# EAGLE design C64_Combi_PSU (EAGLE 9.2.2)
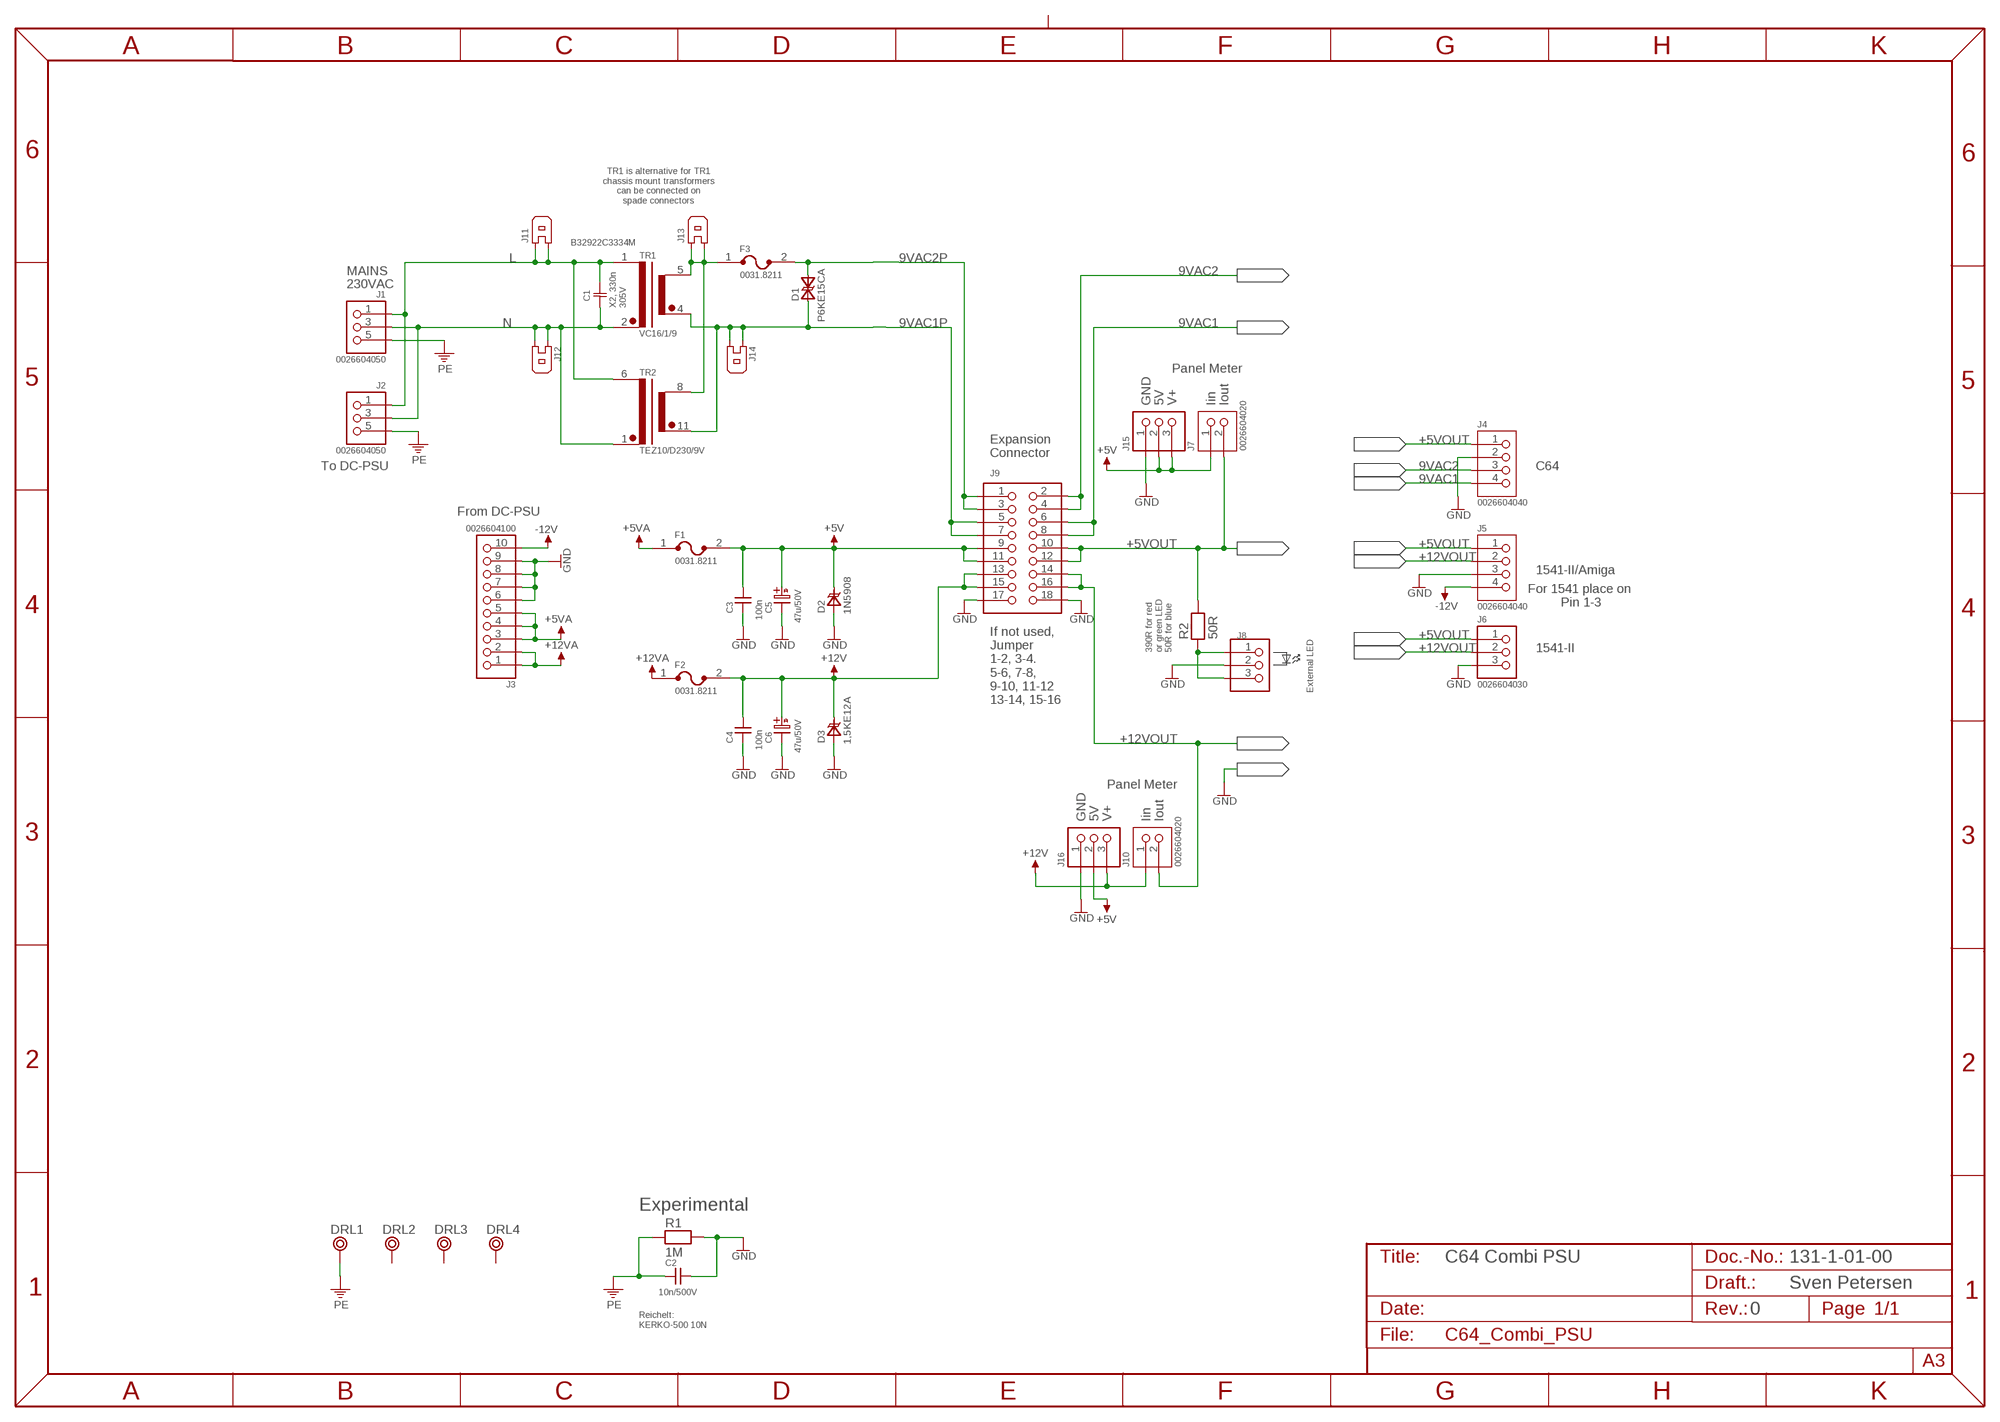
[diagram p0: schematic, sheet 1]

## Parts
C1  B32922C3334M  X2--RM15-18X8  [C-18X8-RM15]
C2  10n/500V  CAP02  [C-5]
C3  100n  CAP01  [C-2,5]
C4  100n  CAP01  [C-2,5]
C5  47u/50V  C07/2,5  [C07/2,5]
C6  47u/50V  C07/2,5  [C07/2,5]
D1  P6KE15CA  [CB417NP]
D2  1N5908  [CB429]
D3  1,5KE12A  [DO-201]
DRL1  BOHR3,5  [BOHR3,5]
DRL2  BOHR3,5  [BOHR3,5]
DRL3  BOHR3,5  [BOHR3,5]
DRL4  BOHR3,5  [BOHR3,5]
F1  0031.8211  [0031.8211]
F2  0031.8211  [0031.8211]
F3  0031.8211  [0031.8211]
J1  0026604050  0026604050MOD  [SPOX_3.96_5P3]
J2  0026604050  0026604050MOD  [SPOX_3.96_5P3]
J3  0026604100  [SPOX_3.96_10P]
J4  0026604040  [SPOX_3.96_4P]
J5  0026604040  [SPOX_3.96_4P]
J6  0026604030  [SPOX_3.96_3P]
J7  0026604020  [SPOX_3.96_2P]
J8  PINHD-1X3  [1X03]
J9  PINHD-2X9  [2X09]
J10  0026604020  [SPOX_3.96_2P]
J11  FLA6,3  [FLA6,3]
J12  FLA6,3  [FLA6,3]
J13  FLA6,3  [FLA6,3]
J14  FLA6,3  [FLA6,3]
J15  6410-3P  [6410-3P]
J16  6410-3P  [6410-3P]
R1  1M  RES04  [R-10]
R2  50R  RES04  [R-10]
TR1  VC16/1/9  [VC16/1/9]
TR2  TEZ10/D230/9V  [TEZ10]

## Nets
9VAC1: J4.4 J9.6 J9.8
9VAC1P: D1.A(A1) J9.5 J9.7 J14.1 J14.2 TR1.4(SEC12) TR2.11(SEC12)
9VAC2: J4.3 J9.2 J9.4
9VAC2P: D1.K(A2) F3.2 J9.1 J9.3
+5V: C3.2 C5.A(+) D2.K F1.2 J7.1 J9.9 J9.11 J15.2 J15.3 J16.2
+5VA: F1.1 J3.3 J3.4 J3.5
+5VOUT: J4.1 J5.1 J6.1 J7.2 J9.10 J9.12 R2.2
+12V: C4.2 C6.A(+) D3.K F2.2 J9.13 J9.15 J10.1 J16.3
+12VA: F2.1 J3.1 J3.2
+12VOUT: J5.2 J6.2 J9.14 J9.16 J10.2
-12V: J3.10 J5.4
GND: C2.2 C3.1 C4.1 C5.K(-) C6.K(-) D2.A D3.A J3.6 J3.7 J3.8 J3.9 J4.2 J5.3 J6.3 J8.2 J9.17 J9.18 J15.1 J16.1 R1.2
L [mains]: C1.2 J1.1 J2.1 J11.1 J11.2 TR1.1(PRI1) TR2.6(PRI1)
N [mains]: C1.1 J1.3 J2.3 J12.1 J12.2 TR1.2(PRI2) TR2.1(PRI2)
N$1: F3.1 J13.1 J13.2 TR1.5(SEC11) TR2.8(SEC11)
N$2: J8.1 J8.3 R2.1
PE [PE]: C2.1 DRL1.P$1 J1.5 J2.5 R1.1
Unconnected: DRL2.P$1 DRL3.P$1 DRL4.P$1

## Notes on the sheet
- TR1 is alternative for TR1
  chassis mount transformers
  can be connected on
  spade connectors
- MAINS
- 230VAC
- X2, 330n
  305V
- Panel Meter
- GND | 5V | V+ | Iin | Iout
- Expansion
  Connector
- To DC-PSU | C64
- From DC-PSU
- 1541-II/Amiga
- For 1541 place on 
  Pin 1-3
- 390R for red
  or green LED
  50R for blue
- 1541-II
- External LED
- If not used,
  Jumper
  1-2, 3-4.
  5-6, 7-8,
  9-10, 11-12
  13-14, 15-16
- Panel Meter
- GND | 5V | V+ | Iin | Iout
- Experimental
- C64 Combi PSU | 131-1-01-00
- Sven Petersen
- 0
- Reichelt:
  KERKO-500 10N

## Library data of the parts
C1 = Epcos_EMV:X2-*: X2-Kondensatoren
C2 = DISCRETE:CAP02
C3 C4 = DISCRETE:CAP01
C5 C6 = ELCO:C07/2,5
D1 = ST:P6KE15CA
D2 = ST:1N5908
D3 = ST:1,5KE12A
DRL1-DRL4 = Mech_Bohr:BOHR3,5
F1-F3 = Schurter:0031.8211
J1 J2 = MOLEX:0026604050MOD
J3 = MOLEX:0026604100
J4 J5 = MOLEX:0026604040
J6 = MOLEX:0026604030
J7 J10 = MOLEX:0026604020
J8 = PINHEAD:PINHD-1X3
J9 = PINHEAD:PINHD-2X9
J11-J14 = Connect:FLA6,3
J15 J16 = MOLEX:6410-3P: 6410/22-27-2031
R1 R2 = DISCRETE:RES04
TR1 = Block:VC16/1/9
TR2 = Breve Tufvassons:TEZ10/D230/9V: tme.eu: TEZ10/D/9V

## Net classes
1 mains: width 1.016 mm, drill 0.6 mm, clearance 5 mm to class 0, clearance 5 mm
2 PE: width 1.016 mm, drill 0.6 mm, clearance 1.5 mm to class 0, clearance 5 mm to class 1

## Board
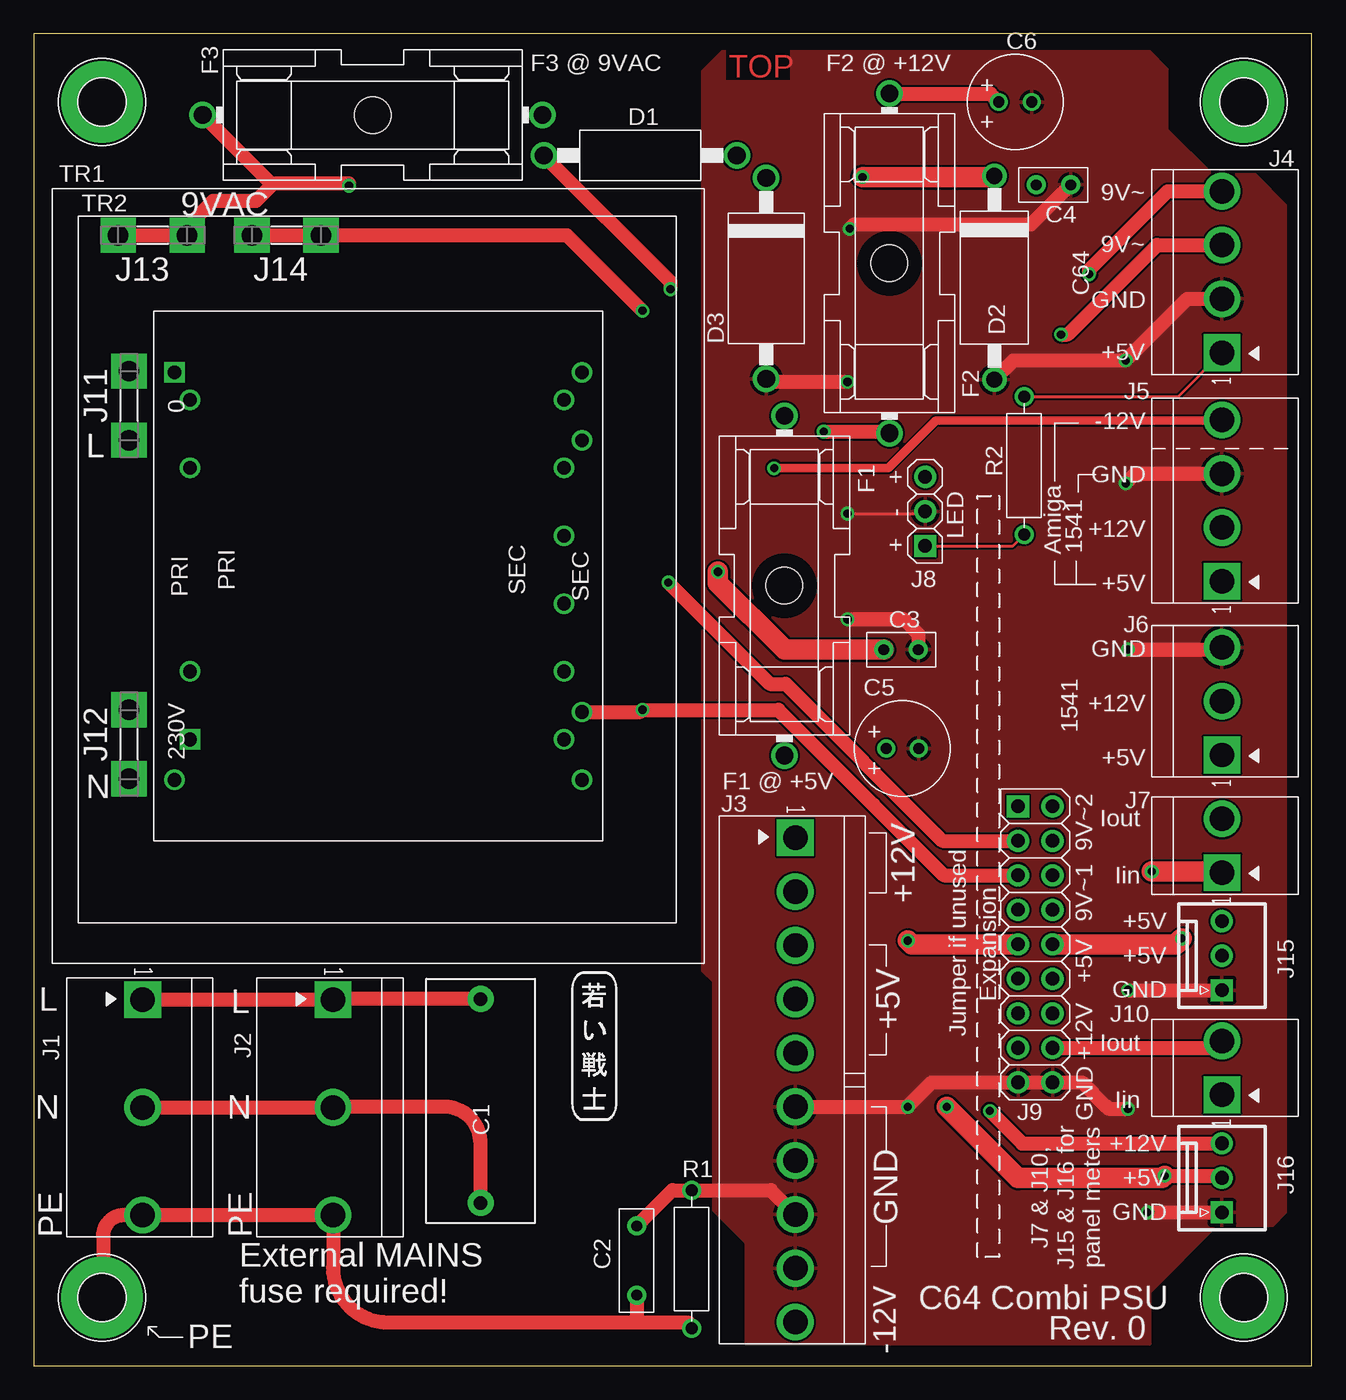
[diagram p1: board, top side]
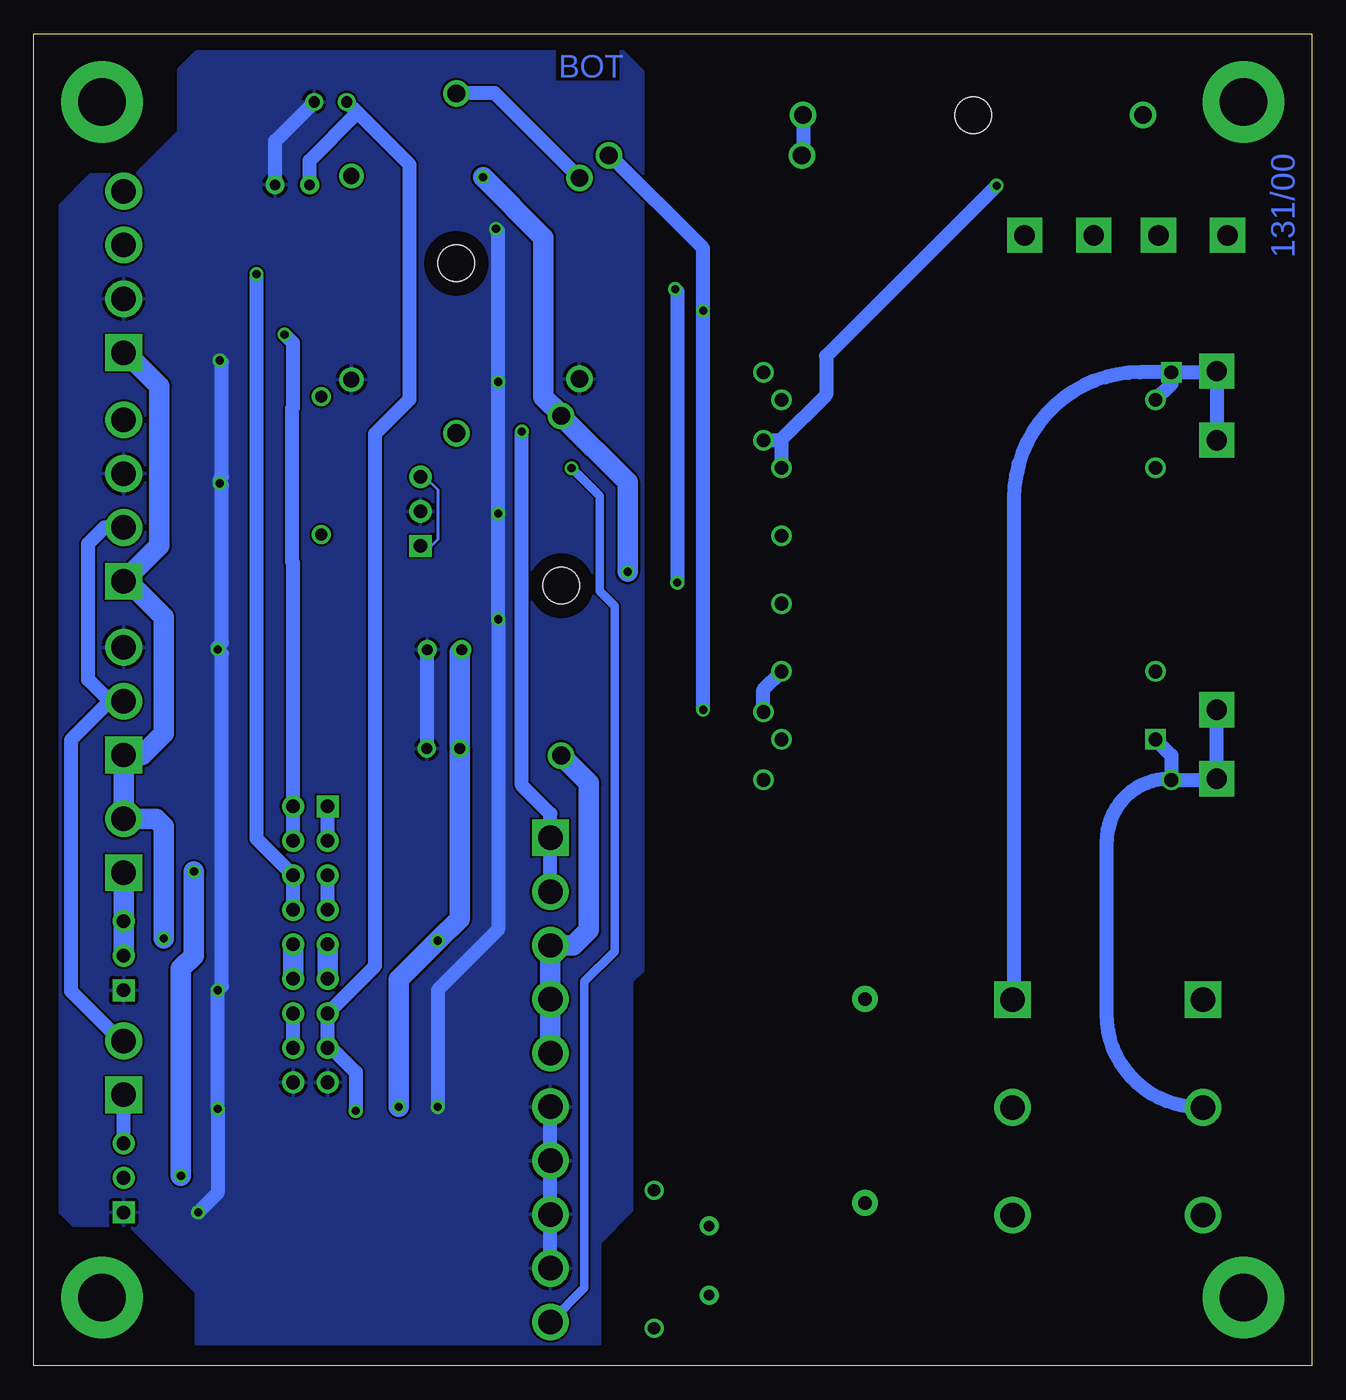
[diagram p2: board, bottom side, seen from below]

Size 94 x 98 mm. Coordinates in mm from the lower left corner, seen from the top.
Outline: 0,0 94,0 94,98 0,98 0,0
Copper layers (1*16): Top 0.035mm / dielectric 1.5mm / Bottom 0.035mm
Design rules "default *": minimum track width 6mil, minimum drill 0.35mm, track to track 6mil, track to pad 6mil, pad to pad 6mil, via to via 6mil, smd to smd 6mil, copper to edge 40mil, drill to drill 6mil, minimum pad ring 10mil, minimum via ring 8mil, stop-mask expansion 4mil, vias tented up to drill 25mil, thermal gap 10mil

### Footprints (pad centres in the part's own frame; a part is rotated, then mirrored left to right if it is on the bottom)
C-18X8-RM15 = drill 1 pad 1.905: 1 -7.5,0; 2 7.5,0
C-5 = drill 0.8 pad 1.397: 1 -2.54,0; 2 2.54,0
C-2,5 = drill 0.8 pad 1.397: 1 -1.27,0; 2 1.27,0
C07/2,5 = drill 0.813 pad 1.27: A -1.202,0; K 1.202,0
CB417NP = drill 1.3: A -7.1,0; K 7.1,0
CB429 = drill 1.2: A -7.5,0; K 7.5,0
DO-201 = drill 1.3: A -7.4,0; K 7.4,0
BOHR3,5 = drill 3.5 pad 6: P$1 0,0
0031.8211 = drill 1.3: 1 -12.5,0; 2 12.5,0 | hole 2.7: 0,0
SPOX_3.96_5P3 = drill 1.8 square: 1 -7.92,0 | drill 1.8: 3 0,0; 5 7.92,0
SPOX_3.96_10P = drill 1.8 square: 1 -17.82,0 | drill 1.8: 2 -13.86,0; 3 -9.9,0; 4 -5.94,0; 5 -1.98,0; 6 1.98,0; 7 5.94,0; 8 9.9,0; 9 13.86,0; 10 17.82,0
SPOX_3.96_4P = drill 1.8 square: 1 -5.94,0 | drill 1.8: 2 -1.98,0; 3 1.98,0; 4 5.94,0
SPOX_3.96_3P = drill 1.8 square: 1 -3.96,0 | drill 1.8: 2 0,0; 3 3.96,0
SPOX_3.96_2P = drill 1.8 square: 1 -1.98,0 | drill 1.8: 2 1.98,0
1X03 = drill 1 pad 1.626 square: 1 -2.54,0 | drill 1 pad 1.626: 2 0,0; 3 2.54,0
2X09 = drill 1 pad 1.626 square: 1 -10.16,-1.27 | drill 1 pad 1.626: 2 -10.16,1.27; 3 -7.62,-1.27; 4 -7.62,1.27; 5 -5.08,-1.27; 6 -5.08,1.27; 7 -2.54,-1.27; 8 -2.54,1.27; 9 0,-1.27; 10 0,1.27; 11 2.54,-1.27; 12 2.54,1.27; 13 5.08,-1.27; 14 5.08,1.27; 15 7.62,-1.27; 16 7.62,1.27; 17 10.16,-1.27; 18 10.16,1.27
FLA6,3 = drill 1.5 pad 2.591 square: 1 -2.54,0; 2 2.54,0
6410-3P = drill 1 pad 1.626 square: 1 -2.54,0 | drill 1 pad 1.626: 2 0,0; 3 2.54,0
R-10 = drill 0.889 pad 1.397: 1 -5.08,0; 2 5.08,0
VC16/1/9 = drill 1 square: 1 -15,15 | drill 1: 2 -15,-15; 3 15,-15; 4 15,-10; 5 15,10; 6 15,15
TEZ10 = drill 1 square: 1 -12.5,13.75 | drill 1: 2 -7.5,13.75; 5 7.5,13.75; 6 12.5,13.75; 7 12.5,-13.75; 8 7.5,-13.75; 9 2.5,-13.75; 10 -2.5,-13.75; 11 -7.5,-13.75; 12 -12.5,-13.75

### Placement (x,y rotation side)
C1  32.86,19.47 90 top
C2  44.33,7.73 90 top
C3  63.8,52.68 180 top
C4  75,86.89 180 top
C5  63.89,45.42 0 top
C6  72.19,93 0 top
D1  44.61,89.06 180 top
D2  70.65,80.06 90 top
D3  53.87,80.01 90 top
DRL1  5,5 0 top
DRL2  89,5 0 top
DRL3  89,93 0 top
DRL4  5,93 0 top
F1  55.21,57.39 90 top
F2  62.93,81.12 90 top
F3  24.91,92.03 0 top
J1  8,19 270 top
J2  22,19 270 top
J3  56.01,21.02 270 top
J4  87.4,80.49 90 top
J5  87.4,63.66 90 top
J6  87.4,48.9 90 top
J7  87.4,38.26 90 top
J8  65.56,62.87 90 top
J9  73.67,31 270 top
J10  87.4,21.91 90 top
J11  6.99,70.64 90 top
J12  6.99,45.72 90 top
J13  8.73,83.19 180 top
J14  18.57,83.19 0 top
J15  87.4,30.16 90 top
J16  87.4,13.81 90 top
R1  48.38,7.83 90 top
R2  72.85,66.23 90 top
TR1  25.33,58.1 0 top
TR2  25.24,58.58 90 top
U$43  [SVEN_TAG]  41.26,23.61 0 top
U$44  [PCB-TITLE/]  -0.16,107.63 0 top  (outside the outline)
U$45  [2LAYER]  51.12,94.77 0 top

### Tracks (layer width: path | path; a pad name or v marks a point on that pad's centre or on a via)
9VAC1  (via drill 0.6)
  Top 1.016: v77.63,80.33 77.63,80.64 83.41,86.43 J4.4
  Bottom 1.016: J9.8 J9.6 77.63,38.77 v77.63,80.33
9VAC1P  (via drill 0.6)
  Top 1.016: TR1.4 44.61,48.1 v44.77,48.26 54.77,48.26 61.75,41.27 66.95,36.08 J9.5 | J14.1 J14.2 39.21,83.19 v44.77,77.63
  Bottom 1.016: v44.77,48.26 v44.77,77.63 44.77,82.23 51.59,89.06 D1.A | J9.7 J9.5 | TR1.4 40.33,49.74 TR2.11
9VAC2  (via drill 0.6)
  Top 1.016: v75.56,75.88 76.04,75.88 82.62,82.47 J4.3
  Bottom 1.016: J9.4 J9.2 74.94,59.1 75,59.16 75,70.45 74.94,70.52 74.94,75.25 v75.56,75.88
9VAC2P  (via drill 0.6)
  Top 1.016: v46.83,79.22 46.83,79.74 D1.K | v46.67,57.63 54.13,50.16 55.3,50.16 66.84,38.62 J9.3
  Bottom 1.016: F3.2 37.41,89.16 D1.K | v46.83,79.22 46.67,79.06 v46.67,57.63 | J9.3 J9.1
+5V  (via drill 0.6)
  Top 1.016: v83.19,13.97 87.24,13.97 J16.2
  Top 1.524: v50.32,58.42 50.32,57.59 55.23,52.68 C3.2 | J9.9 64.57,31 v64.29,31.27 | v67.15,19.05 72.39,13.81 83.03,13.81 v83.19,13.97 | v60.96,87.47 70.56,87.47 D2.K | v82.23,36.35 87.95,36.35 87.87,36.28 J7.1
  Bottom 1.016: 62.69,52.52 C3.2 | 55.21,69.98 F1.2
  Bottom 1.524: J9.11 J9.9 | F1.2 50.32,65 v50.32,58.42 | 62.69,52.52 C5.A 62.69,32.88 v64.29,31.27 67.15,28.42 v67.15,19.05 | v60.96,87.47 56.52,83.03 56.52,71.28 55.21,69.98 | v82.23,36.35 82.23,30.16 83.19,29.21 v83.19,13.97 | J7.1 J15.3 J15.2
+5VA
  Bottom 1.524: J3.5 J3.4 J3.3 54.33,30.92 53.18,32.07 53.18,42.86 F1.1
+5VOUT  (via drill 0.6)
  Top 0.203: R2.2 84.17,71.31 J4.1
  Top 1.524: J9.10 84.02,31 v84.45,31.43
  Bottom 1.524: J9.12 J9.10 | v84.45,31.43 84.45,39.69 85,40.23 J7.2 J6.1 86.03,44.94 84.45,46.51 84.45,55.09 87.15,57.78 87.22,57.72 J5.1 84.77,60.35 84.77,72.07 87.25,74.55 J4.1
+12V  (via drill 0.6)
  Top 1.016: F2.2 70.37,93.62 C6.A | v70.33,18.73 72.71,16.35 J16.3
  Bottom 1.016: D3.K 60.12,93.66 62.89,93.66 F2.2 | v70.33,18.73 70.33,21.59 72.12,23.38 J9.15 J9.13 68.9,29.42 68.9,68.58 66.36,71.12 66.36,88.36 70.12,92.12 | 70.12,92.12 C6.A | C4.2 73.73,88.67 70.28,92.12 70.12,92.12 | J16.3 J10.1
+12VA  (via drill 0.6)
  Top 1.016: v58.1,68.74 62.81,68.74 F2.1
  Bottom 1.016: J3.2 J3.1 | J3.1 56.01,39.18 56.04,39.21 56.04,38.87 J3.1 | J3.1 56.01,40.61 58.1,42.7 v58.1,68.74
+12VOUT
  Top 1.016: J9.16 86.89,23.38 J10.2
  Bottom 1.016: J9.16 J9.14 | 88.42,48.9 91.28,46.04 91.28,27.56 87.61,23.89 J10.2 | 88.42,48.9 J6.2 88.42,48.9 | 88.42,48.9 90.01,50.48 90.01,60.48 88.82,61.68 J5.2
-12V  (via drill 0.6)
  Top 0.61: J5.4 87.33,69.53 66.36,69.53 62.87,66.04 v54.45,66.04
  Bottom 0.61: J3.10 53.5,5.71 53.5,28.26 51.28,30.48 51.28,55.88 52.39,56.99 52.39,63.98 v54.45,66.04
GND  (via drill 0.6)
  Top 0.203: v59.85,62.71 65.41,62.71 J8.2
  Top 1.016: C2.2 46.98,12.91 R1.2 54.22,12.91 J3.8 | J3.6 v64.29,19.04 64.29,19.09 66.05,20.84 J9.17 J9.18 77.11,20.84 78.82,19.13 79.06,18.89 v80.49,18.89 | v59.85,72.39 54.1,72.39 D3.A | v59.85,54.93 63.98,54.93 65.07,53.83 C3.1 | v60.01,83.66 60.34,83.99 73.37,83.99 C4.1 | v80.49,52.7 87.29,52.7 J6.3 | J4.2 84.86,78.51 v80.33,73.98 72.07,73.98 D2.A | v80.33,64.93 81.04,65.64 J5.3 | v81.92,11.27 J16.1 | v80.49,27.62 J15.1
  Bottom 1.016: J3.9 J3.8 J3.7 J3.6 | C5.K 65.07,45.44 C3.1 | v60.01,83.66 59.85,83.5 v59.85,72.39 v59.85,62.71 v59.85,54.93 59.85,32.09 64.29,27.64 v64.29,19.04 | v80.33,73.98 80.17,73.82 80.17,65.41 80.33,65.25 v80.33,64.93 80.17,64.77 80.17,53.18 80.49,52.86 v80.49,52.7 80.17,52.39 80.17,27.94 v80.49,27.62 v80.49,18.89 80.49,12.7 v81.92,11.27 | C4.1 76.27,90.12 C6.K
  pour Bottom: 52.39,1.59 82.07,1.59 82.07,5.4 87,10.32 91.12,10.32 92.08,11.27 92.08,85.41 89.85,87.63 86.52,87.63 83.34,90.81 83.34,95.41 82.07,96.68 50.64,96.68 49.21,95.25 49.21,29.05 50.01,28.26 50.01,11.43 52.39,9.05
  pour Top: 52.39,1.59 82.07,1.59 82.07,5.4 87,10.32 91.12,10.32 92.08,11.27 92.08,85.41 89.85,87.63 86.68,87.63 83.34,90.96 83.34,95.41 82.07,96.68 50.64,96.68 49.21,95.25 49.21,29.05 50.01,28.26 50.01,11.43 52.39,9.05
L
  Top 1.016: C1.2 22.05,26.97 arc90 J2.1 J1.1
  Bottom 1.016: TR1.1 12.63,73.1 arc-90 21.91,63.82 21.91,27.01 arc90 J2.1 | TR1.1 7.07,73.1 J11.2 J11.1 | TR2.6 10.33,72.24 TR1.1
N
  Top 1.016: J1.3 J2.3 arc-90 22.05,19.05 30.16,19.05 arc-90 32.86,16.35 C1.1
  Bottom 1.016: J1.3 8.21,19 arc90 15.08,25.88 15.08,38.58 arc90 10.48,43.18 10.41,43.18 TR1.2 | TR1.2 7.07,43.1 J12.1 J12.2 | TR2.1 10.33,44.92 TR1.2
N$1  (via drill 0.6)
  Top 1.016: v23.18,86.84 23.18,87 17.45,87 | 17.45,87 F3.1 | J13.2 J13.1 11.27,83.82 13.18,85.72 16.35,85.72 17.45,86.82 17.45,87
  Bottom 1.016: TR1.5 39.06,68.1 | 39.06,68.1 35.72,71.44 35.72,74.3 v23.18,86.84 | TR2.8 38.99,68.03 39.06,68.1
N$2
  Top 0.203: J8.1 72.02,60.33 R2.1
  Bottom 0.203: J8.3 65.25,65.41 64.29,64.45 64.29,60.8 64.77,60.33 J8.1
PE
  Top 1.016: DRL1.P$1 arc90 5.08,5.08 5.08,9.53 arc-90 6.63,11.08 J1.5 J2.5 22,7.21 arc90 26.04,3.17 44.29,3.17 | 44.29,3.17 47.96,3.17 arc-90 R1.1 | C2.1 44.33,3.54 arc-90 44.29,3.49 44.29,3.17

### Text on the board
Bottom: 131/00
tPlace: F3 @ 9VAC | F2 @ +12V | 9V~ | 9VAC | 9V~ | C64 | GND | +5V | -12V | L | GND | + | - | LED | 1541 | +12V | + | Amiga | +5V | GND | 1541 | +12V | +5V | N | F1 @ +5V | 9V~2 | Iout | +12V | Iin | 9V~1 | +5V | Jumper if unused | Expansion | +5V | +5V | GND | L | L | +5V | +12V | Iout | GND | Iin | N | N | +12V | +5V | GND | J7 & J10, / J15 & J16 for / panel meters | PE | PE | GND | External MAINS / fuse required! | C64 Combi PSU | -12V | Rev. 0 | PE
tValues: bi- / directional | X2 cap: 330n / 305V | Remove / pin 2 & 4 | Remove / pin 2 & 4
Measures: -12V | 4- 3.5
Document: Sven Petersen | 131-2-01-00 | 2019 | 35µm | 2 | 0